# EAGLE design plug-v23-change-C-at-power-supply (EAGLE 7.6.0)
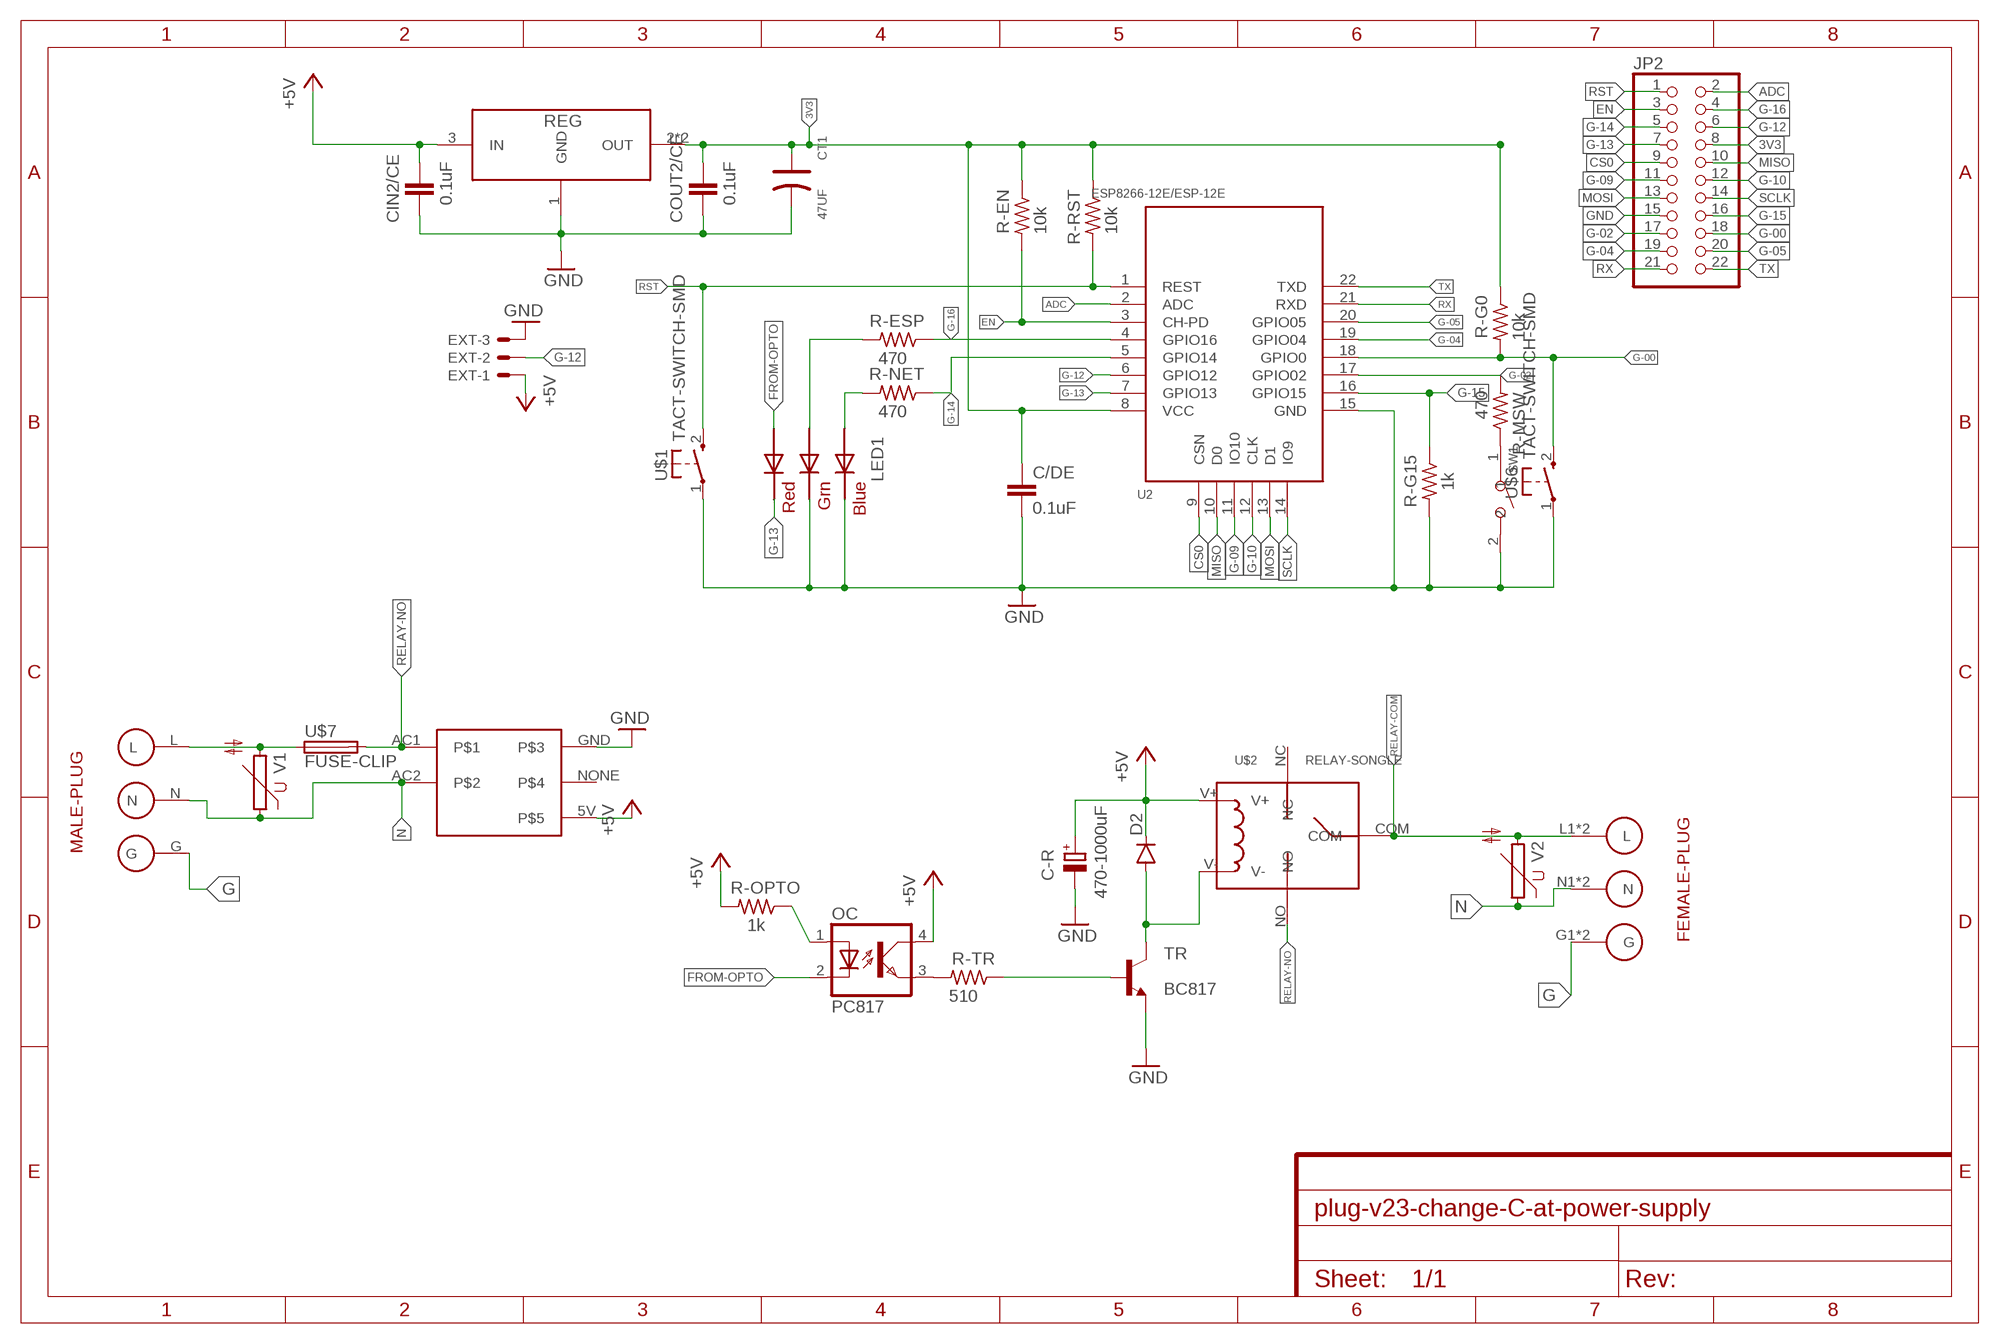
[diagram p0: schematic, sheet 1]

## Parts
C-R  470-1000uF  CPOL-EUE3.5-8  [E3,5-8]
C/DE  0.1uF  C-EUC0805  [C0805]
CIN2/CE  0.1uF  C-EUC0805K  [C0805K]
COUT2/CE  0.1uF  C-EUC0805K  [C0805K]
CT1  47UF  ALUMINUM-SMD-47UF-25V(D6.3-H5.3MM)  [ELECTRO-SMD-C-6MM]
D2  DIODESOD123  [SOD-123]
EXT  53048-03  [53048-03]
JP2  PINHD-2X11  [2X11]
LED1  RGBLED5050  [RGBLED5050]
OC  PC817  [DIL04]
R-EN  10k  R-US_M0805  [M0805]
R-ESP  470  R-US_M0805  [M0805]
R-G0  10k  R-US_M0805  [M0805]
R-G15  1k  R-US_M0805  [M0805]
R-MSW  470  R-US_M0805  [M0805]
R-NET  470  R-US_M0805  [M0805]
R-OPTO  1k  R-US_M0805  [M0805]
R-RST  10k  R-US_M0805  [M0805]
R-TR  510  R-US_M0805  [M0805]
REG  AMS1117-3.3  [SOT-223]
SW1  DIP-BUTTON(2P-6.0X3.0X4.3MM)-TS-1101F  [SW2-5.0-6.0X3.0X4.3MM]
TR  BC817  BC817-16SMD  [SOT23-BEC]
U2  ESP8266-12E/ESP-12E  MOUDLE-WIFI-ESP8266-12E/ESP-12E(22P-24X16MM)  [LGA22-2.0-24X16MM]
U$1  TACT-SWITCH-SMD  [TACT-SWITCH-SMD]
U$2  RELAY-SONGLE  [RELAY-SONGLE]
U$3  MALE-PLUG  [MALE-PLUG]
U$4  POWERSUPPLY-5V-700MA  [POWERSUPPLY-5V-700MA]
U$5  FEMALE-PLUG  [FEMALE-PLUG]
U$6  TACT-SWITCH-SMD  [TACT-SWITCH-SMD]
U$7  FUSE-CLIP  [FUSE-CLIP]
V1  S14K11  [S14K11]
V2  S14K11  [S14K11]

## Nets
3V3: C/DE.1 COUT2/CE.1 CT1.+ JP2.8 R-EN.1 R-G0.1 R-RST.1 REG.2(OUT) REG.4(OUT) U2.8(VCC)
+5V: C-R.+ CIN2/CE.1 D2.C EXT.1 OC.4(COL) R-OPTO.2 REG.3(IN) U$2.V+ U$4.5V
ADC: JP2.2 U2.2(ADC)
CS0: JP2.9 U2.9(CSN)
EN: JP2.3 R-EN.2 U2.3(CH-PD)
FROM-OPTO: LED1.2(RED_A) OC.2(C)
G: U$3.G U$5.G1(G) U$5.G2(G)
G-00: JP2.18 R-G0.2 U2.18(GPIO0) U$6.2(S)
G-02: JP2.17 R-MSW.2 U2.17(GPIO02)
G-04: JP2.19 U2.19(GPIO04)
G-05: JP2.20 U2.20(GPIO05)
G-09: JP2.11 U2.11(IO10)
G-10: JP2.12 U2.12(CLK)
G-12: EXT.2 JP2.6 U2.6(GPIO12)
G-13: JP2.7 LED1.5(RED_C) U2.7(GPIO13)
G-14: JP2.5 R-NET.1 U2.5(GPIO14)
G-15: JP2.16 R-G15.1 U2.16(GPIO15)
G-16: JP2.4 R-ESP.1 U2.4(GPIO16)
GND: C-R.- C/DE.2 CIN2/CE.2 COUT2/CE.2 CT1.- EXT.3 JP2.15 LED1.4(BLUE_C) LED1.6(GREEN_C) R-G15.2 REG.1(GND) SW1.2 TR.E U2.15(GND) U$1.1(P) U$4.GND U$6.1(P)
LINE: U$3.L U$7.3 U$7.4 V1.2
MISO: JP2.10 U2.10(D0)
MOSI: JP2.13 U2.13(D1)
N: U$3.N U$4.AC2 U$5.N1(N) U$5.N2(N) V1.1 V2.1
N$1: OC.3(EMIT) R-TR.2
N$2: R-TR.1 TR.B
N$5: LED1.1(GREEN_A) R-ESP.2
N$6: LED1.3(BLUE_A) R-NET.2
N$13: OC.1(A) R-OPTO.1
N$17: D2.A TR.C U$2.V-
N$22: R-MSW.1 SW1.1
RELAY-COM: U$2.COM U$5.L1(L) U$5.L2(L) V2.2
RELAY-NO: U$2.NO U$4.AC1 U$7.5 U$7.6
RST: JP2.1 R-RST.2 U2.1(REST) U$1.2(S)
RX: JP2.21 U2.21(RXD)
SCLK: JP2.14 U2.14(IO9)
TX: JP2.22 U2.22(TXD)
Unconnected: U$2.NC U$4.NONE

## Library data of the parts
C-R = rcl:CPOL-EU: POLARIZED CAPACITOR, European symbol
C/DE CIN2/CE COUT2/CE = rcl:C-EU: CAPACITOR, European symbol
CT1 = Seeed-OPL-Capacitor:ALUMINUM-SMD-47UF-25V(D6.3-H5.3MM): 302030059; MPN: CS1E470M-CRE54
D2 = SparkFun-DiscreteSemi:DIODE: Diode These are standard reverse protection diodes and small signal diodes. SMA package can handle up to about 1A. SOD-323 can handle about 200mA. What the SOD-323 package when ordering, there are some mfgs out there that are 5-pin packages.
EXT = con-molex:53?-03: CONNECTOR wire to board 1.25 mm (.049 inch) pitch header; MF: WALDOM/MOLEX; MPN: 53048-0310; OC_FARNELL: 9732918; OC_NEWARK: 38C9908
JP2 = pinhead:PINHD-2X11: PIN HEADER
LED1 = adafruit:RGBLED: For 5050 RGB LEDs, the order of the LEDs may vary from one manufacturer to another!
OC = optocoupler:PC817: SHARP OPTO COUPLER; MPN: PC817X4J000F; OC_FARNELL: 9707727; OC_NEWARK: 97K7059
R-EN R-ESP R-G0 R-G15 R-MSW R-NET R-OPTO R-RST R-TR = rcl:R-US_: RESISTOR, American symbol
REG = AMS1117-3.3:AMS1117-3.3: 1A LOW DROPOUT VOLTAGE REGULATOR
SW1 = Seeed-OPL-Switch:DIP-BUTTON(2P-6.0X3.0X4.3MM): 311020025
TR = transistor-npn:BC817*: NPN Transistor
U2 = Seeed-OPL-Moudle:MOUDLE-WIFI-ESP8266-12E/ESP-12E(22P-24X16MM): 317060015; MPN: ESP8266-12E/ESP-12E
U$1 U$6 = Tact-Switch-SMD:TACT-SWITCH-SMD: Tong - SMD Tact Switch 2 pins
U$2 = Relay-Songle:RELAY-SONGLE
U$3 = Male-Female-PLUG:MALE-PLUG
U$4 = PowerSupply-5V-700mA:POWERSUPPLY-5V-700MA
U$5 = Male-Female-PLUG:FEMALE-PLUG
U$7 = Fuse-Clip:FUSE-CLIP
V1 V2 = varistor:S14K11: VARISTOR

## Board
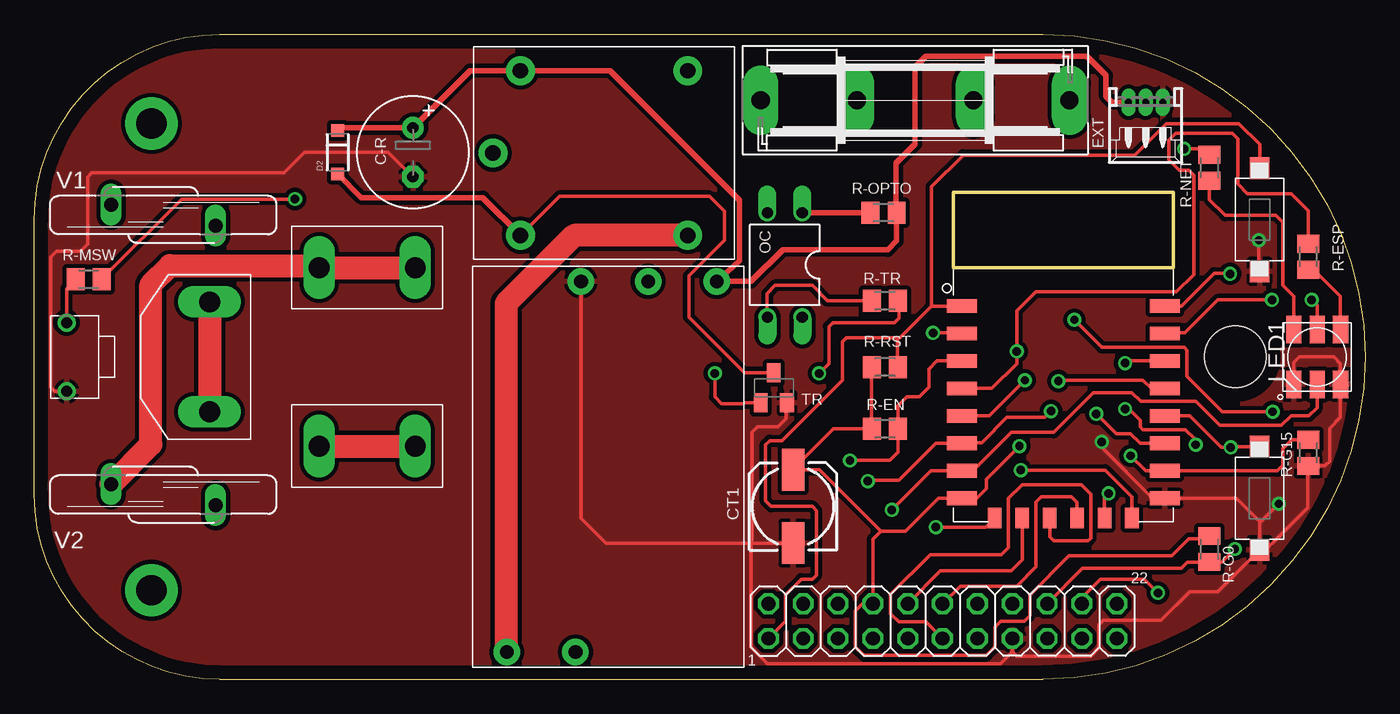
[diagram p1: board, top side]
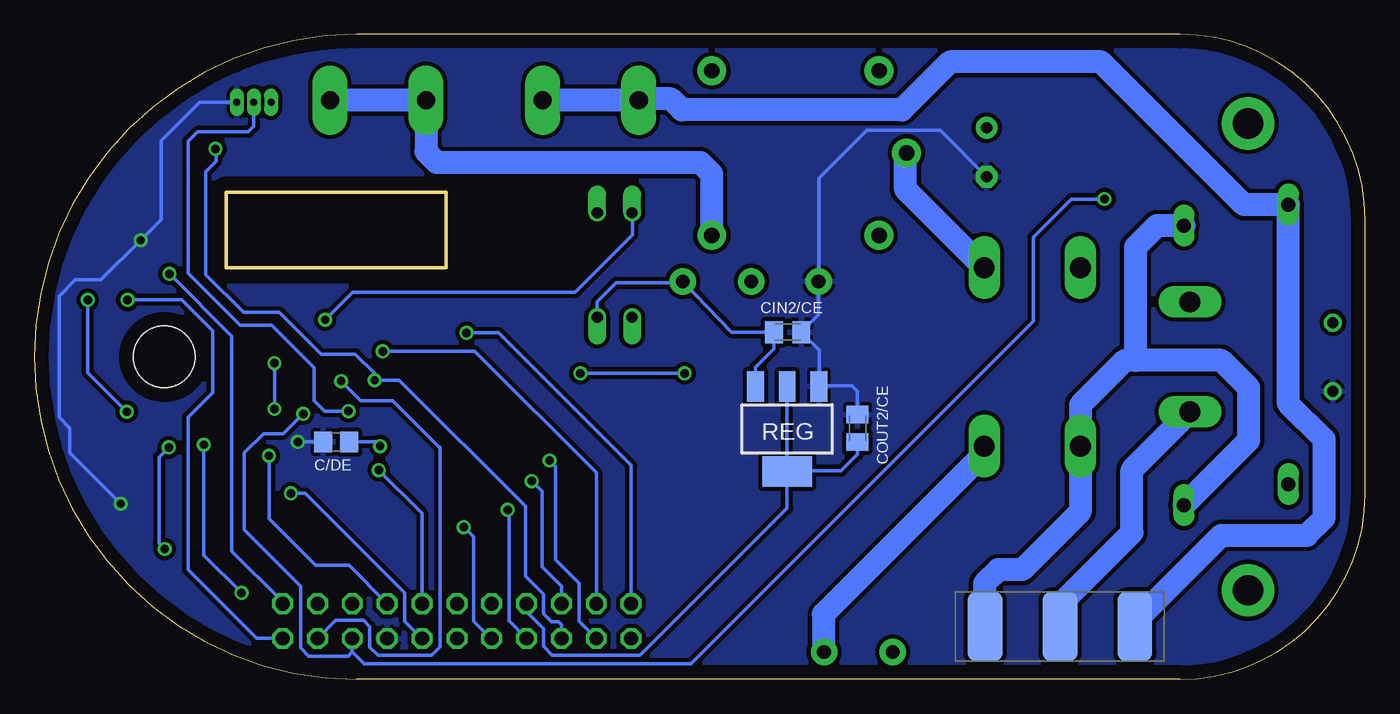
[diagram p2: board, bottom side, seen from below]

Size 97 x 47 mm. Coordinates in mm from the lower left corner, seen from the top.
Outline: 13.5,0 73.5,0 arc180 73.5,47 13.5,47 arc90 0,33.5 0,13.5 arc90 13.5,0
Outline: 67,30 83,30 83,35.5 67,35.5 67,30
Copper layers (1*16): Top 0.035mm / dielectric 1.5mm / Bottom 0.035mm
Design rules "default": minimum track width 10mil, minimum drill 24mil, track to track 8mil, track to pad 8mil, pad to pad 8mil, via to via 8mil, smd to smd 8mil, copper to edge 40mil, drill to drill 8mil, minimum pad ring 10mil, minimum via ring 8mil, stop-mask expansion 4mil, vias tented up to drill 0mil, thermal gap 10mil
Holes 4.5 mm at 87.54,23.5

### Footprints (pad centres in the part's own frame; a part is rotated, then mirrored left to right if it is on the bottom)
E3,5-8 = drill 0.813 pad 1.6: + -1.778,0 | drill 0.813 pad 1.6 octagon: - 1.778,0
C0805 = smd 1.3 x 1.5: 1 -0.95,0; 2 0.95,0
C0805K = smd 1.3 x 1.6: 1 -1,0; 2 1,0
ELECTRO-SMD-C-6MM = smd 3.048 x 1.651: + 2.667,0; - -2.667,0
SOD-123 = smd 0.9 x 0.95: A 1.575,0; C -1.575,0
53048-03 = drill 0.5 pad 0.698 long: 1 1.25,-1.25; 2 0,-1.25; 3 -1.25,-1.25
2X11 = drill 1.016 octagon: 1 -12.7,-1.27; 2 -12.7,1.27; 3 -10.16,-1.27; 4 -10.16,1.27; 5 -7.62,-1.27; 6 -7.62,1.27; 7 -5.08,-1.27; 8 -5.08,1.27; 9 -2.54,-1.27; 10 -2.54,1.27; 11 0,-1.27; 12 0,1.27; 13 2.54,-1.27; 14 2.54,1.27; 15 5.08,-1.27; 16 5.08,1.27; 17 7.62,-1.27; 18 7.62,1.27; 19 10.16,-1.27; 20 10.16,1.27; 21 12.7,-1.27; 22 12.7,1.27
RGBLED5050 = smd 2 x 1.1: 1 -2,1.7; 2 -2,0; 3 -2,-1.7; 4 2,-1.7; 5 2,0; 6 2,1.7
DIL04 = drill 0.813 offset: 1 -1.27,-3.81; 2 1.27,-3.81; 3 1.27,3.81; 4 -1.27,3.81
M0805 = smd 1.3 x 1.6: 1 -0.95,0; 2 0.95,0
SOT-223 = smd 1.219 x 2.235: 1 -2.381,-3.099; 2 -0.07,-3.099; 3 2.241,-3.099 | smd 3.6 x 2.2: 4 -0.07,3.099
SW2-5.0-6.0X3.0X4.3MM = drill 0.8 pad 1.27: 1 -2.5,0; 2 2.5,0
SOT23-BEC = smd 1 x 1.4: B -0.95,-1.1; C 0,1.1; E 0.95,-1.1
LGA22-2.0-24X16MM = smd 2.2 x 1: 1 -7.4,3.7; 2 -7.4,1.7; 3 -7.4,-0.3; 4 -7.4,-2.3; 5 -7.4,-4.3; 6 -7.4,-6.3; 7 -7.4,-8.3; 8 -7.4,-10.3; 15 7.4,-10.3; 16 7.4,-8.3; 17 7.4,-6.3; 18 7.4,-4.3; 19 7.4,-2.3; 20 7.4,-0.3; 21 7.4,1.7; 22 7.4,3.7 | smd 1 x 1.5: 9 -5,-11.75; 10 -3,-11.75; 11 -1,-11.75; 12 1,-11.75; 13 3,-11.75; 14 5,-11.75
TACT-SWITCH-SMD = smd 1.6 x 1.4: 1 -3.75,0; 2 3.75,0
RELAY-SONGLE = drill 1.118 pad 2.1: COM -8.1,0; NC 6.1,6; NO 6.1,-6; V+ -6.1,6; V- -6.1,-6
MALE-PLUG = smd 5.08 x 2.54: G 0,0; L 0,5.46; N 0,-5.46
POWERSUPPLY-5V-700MA = drill 1 pad 1.93: 5V 13.5,-7.9; AC1 -13.5,7.4; AC2 -13.5,2.4; GND 13.5,2; NONE 13.5,-2.9
FEMALE-PLUG = drill 1.524 long: G1 -6.73,4; G2 -6.73,-4; L1 1.27,6.5; L2 8.27,6.5; N1 1.27,-6.5; N2 8.27,-6.5
FUSE-CLIP = drill 1.321 pad 2.54 long: 1 -11.252,0; 2 11.252,0; 3 -11.252,0; 4 -4.252,0; 5 11.252,0; 6 4.252,0
S14K11 = drill 1.016 long: 1 -0.762,-3.81; 2 0.762,3.81

### Placement (x,y rotation side)
C-R  27.59,38.41 270 top
C/DE  75,17.3 180 bottom
CIN2/CE  42.1,25.3 0 bottom
COUT2/CE  37,18.3 90 bottom
CT1  55.3,12.6 90 top
D2  22.1,38.41 270 top
EXT  81,40.8 180 top
JP2  66.2,4.25 0 top
LED1  93.5,23.5 270 top
OC  54.7,30.2 180 top
R-EN  62,18.25 0 top
R-ESP  92.85,30.8 270 top
R-G0  85.65,9.5 270 top
R-G15  92.85,16.5 270 top
R-MSW  3.96,29.14 0 top
R-NET  85.65,37.28 270 top
R-OPTO  61.9,34 0 top
R-RST  62,22.75 0 top
R-TR  62,27.6 180 top
REG  42.2,18.25 180 bottom
SW1  2.35,23.5 270 top
TR  53.9,21.25 0 top
U2  75,23.5 0 top
U$1  89.3,33.5 90 top
U$2  41.53,38.35 0 top
U$3  22.25,3.85 270 bottom
U$4  41.84,15.5 90 top
U$5  19.5,23.5 0 top
U$6  89.3,13.2 90 top
U$7  64.2,42.2 0 top
V1  9.4,33.83 90 top
V2  9.4,13.46 90 top

### Tracks (layer width: path | path; a pad name or v marks a point on that pad's centre or on a via)
3V3  (via drill 0.61)
  Top 0.254: 61,18.25 61,22.75 R-RST.1 | 61,18.25 58.25,18.25 55.3,15.3 CT1.+ 57.23,15.27 61.7,10.8 | 61,18.25 R-EN.1 | R-G0.1 85.5,10.25 84.15,10.25 82.9,9 75.4,9 72.55,6.15 72.55,4.65 72.15,4.25 70.45,4.25 70,3.8 70,2.3 69.95,2.3 69.4,1.75 60.45,1.75 59.85,2.35 59.85,5 60.37,5.52 JP2.8 61.12,10.22 61.7,10.8 | 61.7,10.8 63.5,10.8 65.9,13.2 U2.8 68.7,13.2 69.4,13.9 69.4,14.6 v71.8,17
  Bottom 0.254: 42,21.25 REG.2 REG.4 | C/DE.1 72.1,17.3 v71.8,17 | COUT2/CE.1 37,16.4 38.2,15.2 42.08,15.2 REG.4 | JP2.8 61.1,5.5 61.1,4.9 59.9,3.7 59.9,2.4 59.25,1.75 52.85,1.75 42.13,12.47 REG.4
+5V
  Top 0.254: D2.C 22.3,40.19
  Top 0.406: 22.3,40.19 C-R.+ 31.75,44.35 U$2.V+ 41.95,44.35 51.4,34.9 51.4,30.51 U$4.5V 52.25,29 54.55,31.3 62.2,31.3 62.85,31.95 62.85,33.5 | EXT.1 78.55,42.05 78.1,42.5 78.1,44 76.7,45.4 65,45.4 64.2,44.6 64.2,39 62.8,37.6 62.8,33.55 62.85,33.5 | R-OPTO.2 62.85,33.5
  Bottom 0.254: REG.3 44.44,22.76 43.1,24.1 CIN2/CE.1 46.19,25.3 U$4.5V 49.79,28.9 54.6,28.9 55.97,27.53 OC.4
ADC  (via drill 0.61)
  Top 0.254: v65.5,25.25 67.5,25.25 U2.2
  Bottom 0.254: JP2.2 53.5,15.6 63.15,25.25 v65.5,25.25
CS0  (via drill 0.61)
  Top 0.254: v65.7,11.1 69.35,11.1 U2.9
  Bottom 0.254: JP2.9 63.75,3 65,4.25 65,10.4 v65.7,11.1
EN  (via drill 0.61)
  Top 0.254: v59.45,15.95 62.35,15.95 62.95,16.55 R-EN.2 62.95,19.95 63.6,20.6 64.5,20.6 65.2,21.3 65.2,22.6 65.8,23.2 U2.3
  Bottom 0.254: JP2.3 57.3,4.24 57.3,7 59,8.7 59,15.5 v59.45,15.95
FROM-OPTO  (via drill 0.61)
  Top 0.254: v75.8,26.2 77.8,24.2 83.8,24.2 84,24 84,22.1 86.6,19.5 v90.25,19.5 | v93.1,27.65 93.5,27.25 LED1.2
  Bottom 0.254: v90.25,19.5 93.1,22.35 v93.1,27.65 | OC.2 53.4,33.98 53.4,32.4 57.6,28.2 73.8,28.2 v75.8,26.2
G
  Top 1.676: U$5.G1 U$5.G2
  Bottom 1.676: U$3.G 22.25,5.45 17,10.7 17,15.27 U$5.G2
G-00  (via drill 0.61)
  Top 0.254: v87.5,9.5 86.55,8.55 R-G0.2 84.05,8.55 83.6,8.1 76.4,8.1 JP2.18 | U$6.2 87.25,16.95 v87.2,16.9 86.5,16.9 84.2,19.2 U2.18
  Bottom 0.254: v87.2,16.9 87.9,16.2 87.9,9.9 v87.5,9.5
G-02  (via drill 0.61)
  Top 0.254: v19,35 10.75,35 5,29.25 R-MSW.2 | U2.17 80.6,17.2 79.9,17.9 78.85,17.9 v77.4,19.35
  Bottom 0.254: 73.82,2.02 JP2.17 | 73.82,2.02 74.14,1.7 77,1.7 77.6,2.3 77.6,6.8 81.7,10.9 81.7,16.5 80.3,17.9 78.85,17.9 v77.4,19.35 | v19,35 21.4,35 24.2,32.2 24.2,26.1 49.15,1.15 72.95,1.15 73.82,2.02
G-04  (via drill 0.61)
  Top 0.254: U2.19 81.4,21.2 80.8,21.8 74.71,21.8 v74.64,21.73
  Bottom 0.254: JP2.19 75.04,4.3 73,4.3 72.55,3.85 72.55,2.35 71.95,1.75 68.05,1.75 67.44,2.36 67.44,16.9 67.5,16.9 70.9,20.3 73.2,20.3 v74.63,21.73 v74.64,21.73
G-05  (via drill 0.61)
  Top 0.254: JP2.20 76.36,5.96 77.7,7.3 80.9,7.3 v81.9,6.3 | U2.20 79.65,23.2 v79.5,23.05 | v84.65,17.1 84.65,17.45 83.9,18.2 80.8,18.2 80.6,18.4 80.6,18.9 79.8,19.7 v79.5,19.7
  Bottom 0.254: v81.9,6.3 84.65,9.05 v84.65,17.1 | v79.5,23.05 v79.5,19.7
G-09
  Top 0.254: JP2.11 64.98,4.2 63,4.2 62.4,4.8 62.4,6.2 65.3,9.1 70.5,9.1 71,9.6 71,13.2 72,14.2 76.3,14.2 77,13.5 77,10.3 76.8,10.1 74.3,10.1 74,10.4 U2.11
G-10
  Top 0.254: JP2.12 67.48,6.8 71.6,6.8 73,8.2 73,12.9 73.4,13.3 75.6,13.3 76,12.9 U2.12
G-12  (via drill 0.61)
  Top 0.254: v60.75,14.45 60.8,14.5 63,14.5 65.7,17.2 U2.6 67.65,17.25 69.05,17.25 70.9,19.1 73.65,19.1 v74.1,19.55
  Bottom 0.254: EXT.2 81,40.3 81.4,39.9 85.1,39.9 85.8,39.2 85.8,29.6 82,25.8 79.7,25.8 76.6,22.7 76.6,20.3 75.85,19.55 v74.1,19.55 | JP2.6 58.58,6.78 60,8.2 60,13.7 v60.75,14.45
G-13  (via drill 0.61)
  Top 0.254: LED1.5 93.5,19.8 92.9,19.2 91.6,19.2 90.9,18.5 86.4,18.5 84.65,20.25 80.65,20.25 80,20.9 77.2,20.9 74.3,18 71.2,18 68.4,15.2 U2.7 65.35,15.2 v62.5,12.35
  Bottom 0.254: JP2.7 62.4,4.26 62.4,12.25 v62.5,12.35
G-14  (via drill 0.61)
  Top 0.254: v72.2,21.8 69.6,19.2 U2.5 | 85.48,38.4 R-NET.1 85.23,38.65 v83.8,38.65
  Bottom 0.254: JP2.5 58.58,3.98 58.8,4.2 59.3,4.2 59.9,4.8 59.9,6.2 61.2,7.5 61.2,12.6 70.4,21.8 v72.2,21.8 72.2,22.3 73.6,23.7 76.1,23.7 79.15,26.75 81.75,26.75 84.5,29.5 84.5,37 83.75,37.75 83.75,38.6 v83.8,38.65
G-15  (via drill 0.61)
  Top 0.254: R-G15.1 91.65,17.45 91,16.8 91,15.6 90.6,15.2 U2.16 81,15.2 v79.9,16.3
  Bottom 0.254: v79.9,16.3 79.9,11.7 76.5,8.3 74.06,8.3 JP2.16
G-16  (via drill 0.61)
  Top 0.254: U2.4 69.8,21.2 71.6,23 v71.6,23.9 71.6,26.85 73,28.25 83.25,28.25 84.5,29.5 84.5,36.75 84.15,37.1 83.45,37.1 82.7,37.85 82.7,39.3 83.2,39.8 87.3,39.8 87.7,39.4 87.7,36.1 88.4,35.4 91.6,35.4 92.85,34.15 R-ESP.1
  Bottom 0.254: v71.6,23.9 64.9,23.9 56.04,15.04 JP2.4
GND  (via drill 0.61)
  Top 0.254: U$6.1 89.75,9.45 92.8,12.5 92.8,15.5 R-G15.2 94.05,15.55 94.4,15.9 94.4,18.3 95.2,19.1 LED1.6 95.2,23 94.7,23.5 92.2,23.5 91.8,23.1 LED1.4 | JP2.15 71.28,2.02 | 71.28,2.02 71.6,1.7 77,1.7 77.6,2.3 77.6,4 77.9,4.3 82.1,4.3 84.2,6.4 86.25,6.4 U$6.1 | 71.28,2.02 71.25,2 71.25,1.95 71.2,1.95 70.4,1.15 53.45,1.15 52.25,2.35 52.25,9.93 | C-R.- 27.57,36.63 25.8,38.4 19.7,38.4 18.2,36.9 4.2,36.9 3.9,36.6 3.9,31.7 3.4,31.2 1.65,31.2 1.2,30.75 1.2,21.3 1.5,21 SW1.2 | v89.25,32 89.25,29.75 U$1.1 | v90.7,12.8 89.3,11.4 | 89.3,11.4 U$6.1 | 89.3,11.4 89.3,11.5 87.6,13.2 U2.15 81.5,13.2 77.8,16.9 v77.8,17.3 | TR.E 54.8,20.1 54.8,19 54.2,18.4 52.7,18.4 52.3,18 52.3,9.93 | U$4.GND 39.84,11.76 41.67,9.93 52.25,9.93 | 52.3,9.93 CT1.- | 52.25,9.93 52.3,9.93
  Bottom 0.254: EXT.3 84.95,42.05 87.75,39.25 87.75,33.5 v89.25,32 92.15,29.1 94,29.1 95.2,27.9 95.2,19.1 94.4,18.3 94.4,16.5 v90.7,12.8 | C/DE.2 v77.8,17.3 | COUT2/CE.2 37,21 37.4,21.4 39.77,21.4 | 39.77,21.4 REG.1 | 39.77,21.4 39.77,23.97 CIN2/CE.2 39.84,26.56 U$4.GND 39.8,28.89 39.8,36.5 36.3,40 30.96,40 C-R.-
  pour Top (isolate 0.305): 0,0 98.15,0 98.15,47.7 0,47.7
  pour Bottom (isolate 0.305): 0,0 98.15,0 98.15,47.7 0,47.7
LINE
  Bottom 1.676: U$3.L 16.79,4.21 10.5,10.5 4.25,10.5 3,11.75 3,17.5 5.59,20.09 V1.2 8.84,34.59 19.25,45 30.25,45 33.75,41.5 49.8,41.5 50.6,42.3 52.95,42.3 U$7.3 U$7.4
MISO
  Top 0.254: U2.10 72,8.7 71.2,7.9 66.04,7.9 JP2.10
MOSI  (via drill 0.61)
  Top 0.254: U2.13 78,13.25 v78.3,13.55
  Bottom 0.254: JP2.13 70,4.24 70,6.3 77.25,13.55 v78.3,13.55
N
  Top 1.676: U$5.N1 U$5.N2
  Bottom 1.676: U$5.N2 27.77,16.48 39.5,4.75 39.5,1.91 U$4.AC2 | U$3.N 27.75,3.89 27.75,7 26.75,8 25,8 20.77,12.23 U$5.N1 20.75,17.02 20.75,20 17.5,23.25 16.75,23.25 | 16.75,23.25 10.5,23.25 8.5,21.25 8.5,17.41 V2.1 | V1.1 15.18,33.07 16.75,31.5 16.75,23.25
N$1
  Top 0.254: R-TR.2 57.8,27.6 56.7,28.7 54,28.7 53.4,28.1 53.4,26.42 OC.3
N$2  (via drill 0.61)
  Top 0.254: R-TR.1 63,27.5 63,26.3 62.7,26 58.2,26 57.9,25.7 57.9,23 v57.2,22.3 | TR.B 51.75,20.15 51.7,20.1 50.1,20.1 49.6,20.6 v49.6,22.3
  Bottom 0.254: v49.6,22.3 v57.2,22.3
N$3  (via drill 2.2 pad 3.81)
  other vias: 8.54,6.5
N$4  (via drill 2.2 pad 3.81)
  other vias: 8.54,40.5
N$5
  Top 0.254: R-ESP.2 93.25,29.85 95.2,27.9 LED1.1
N$6
  Top 0.254: LED1.3 91.8,27.9 91,28.7 91,33.3 90.5,33.8 86.8,33.8 85.65,34.95 R-NET.2
N$13
  Top 0.406: OC.1 R-OPTO.1
N$17
  Top 0.254: TR.C 51.75,22.35 47.7,26.4 47.7,29.4 50.3,32 50.3,34.1 49.2,35.2 38.28,35.2 U$2.V-
  Top 0.406: D2.A 23.84,35.1 32.68,35.1 U$2.V-
N$22
  Top 0.254: SW1.1 2.35,28.48 R-MSW.1
RELAY-COM
  Top 1.676: U$5.L2 U$5.L1 20.62,30.15 9.9,30.15 8.5,28.75 8.5,17.13 V2.2
  Bottom 1.676: U$5.L2 27.8,30 33.5,35.7 33.5,38.28 U$2.COM
RELAY-NO
  Top 1.676: U$2.NO 39.35,32.35 34.4,27.4 34.4,1.89 U$4.AC1
  Bottom 1.676: U$7.5 U$7.6 68.45,38.45 67.65,37.65 48.45,37.65 47.63,36.83 U$2.NO
RST
  Top 0.254: U$1.2 89.3,39 87.8,40.5 82.5,40.5 80.2,38.2 67.7,38.2 65.4,35.9 65.4,27.2 | 65.4,27.2 U2.1 | 65.4,27.2 63.1,24.9 62.9,24.9 | R-RST.2 62.9,22.8 62.9,24.9 | 62.9,24.9 59.2,24.9 58.9,24.6 58.9,21.8 54.5,17.4 53.6,17.4 53.3,17.1 53.3,13 53.7,12.6 56.7,12.6 57,12.3 57,7.6 56.7,7.3 55.9,7.3 54.8,6.2 54.75,6.2 54.75,4.23 JP2.1
RX  (via drill 0.61)
  Top 0.254: U2.21 82.5,25.25 83.85,25.25 86.25,27.65 v90.2,27.65
  Bottom 0.254: JP2.21 78.92,3 80.8,3 85.8,8 85.8,19.1 84,20.9 84,25.4 84.22,25.62 86.25,27.65 v90.2,27.65
SCLK  (via drill 0.61)
  Top 0.254: U2.14 80,13.3 78.05,15.25 v71.9,15.25
  Bottom 0.254: JP2.14 68.74,12.09 v71.9,15.25
TX  (via drill 0.61)
  Top 0.254: U2.22 83.6,27.2 86,29.6 87.1,29.6 v87.15,29.55
  Bottom 0.254: JP2.22 79,5.75 82.6,9.35 82.6,25 v87.15,29.55

### Text on the board
tNames: 22 | 1